# EAGLE schematic mv-uart (EAGLE 7.6.0)
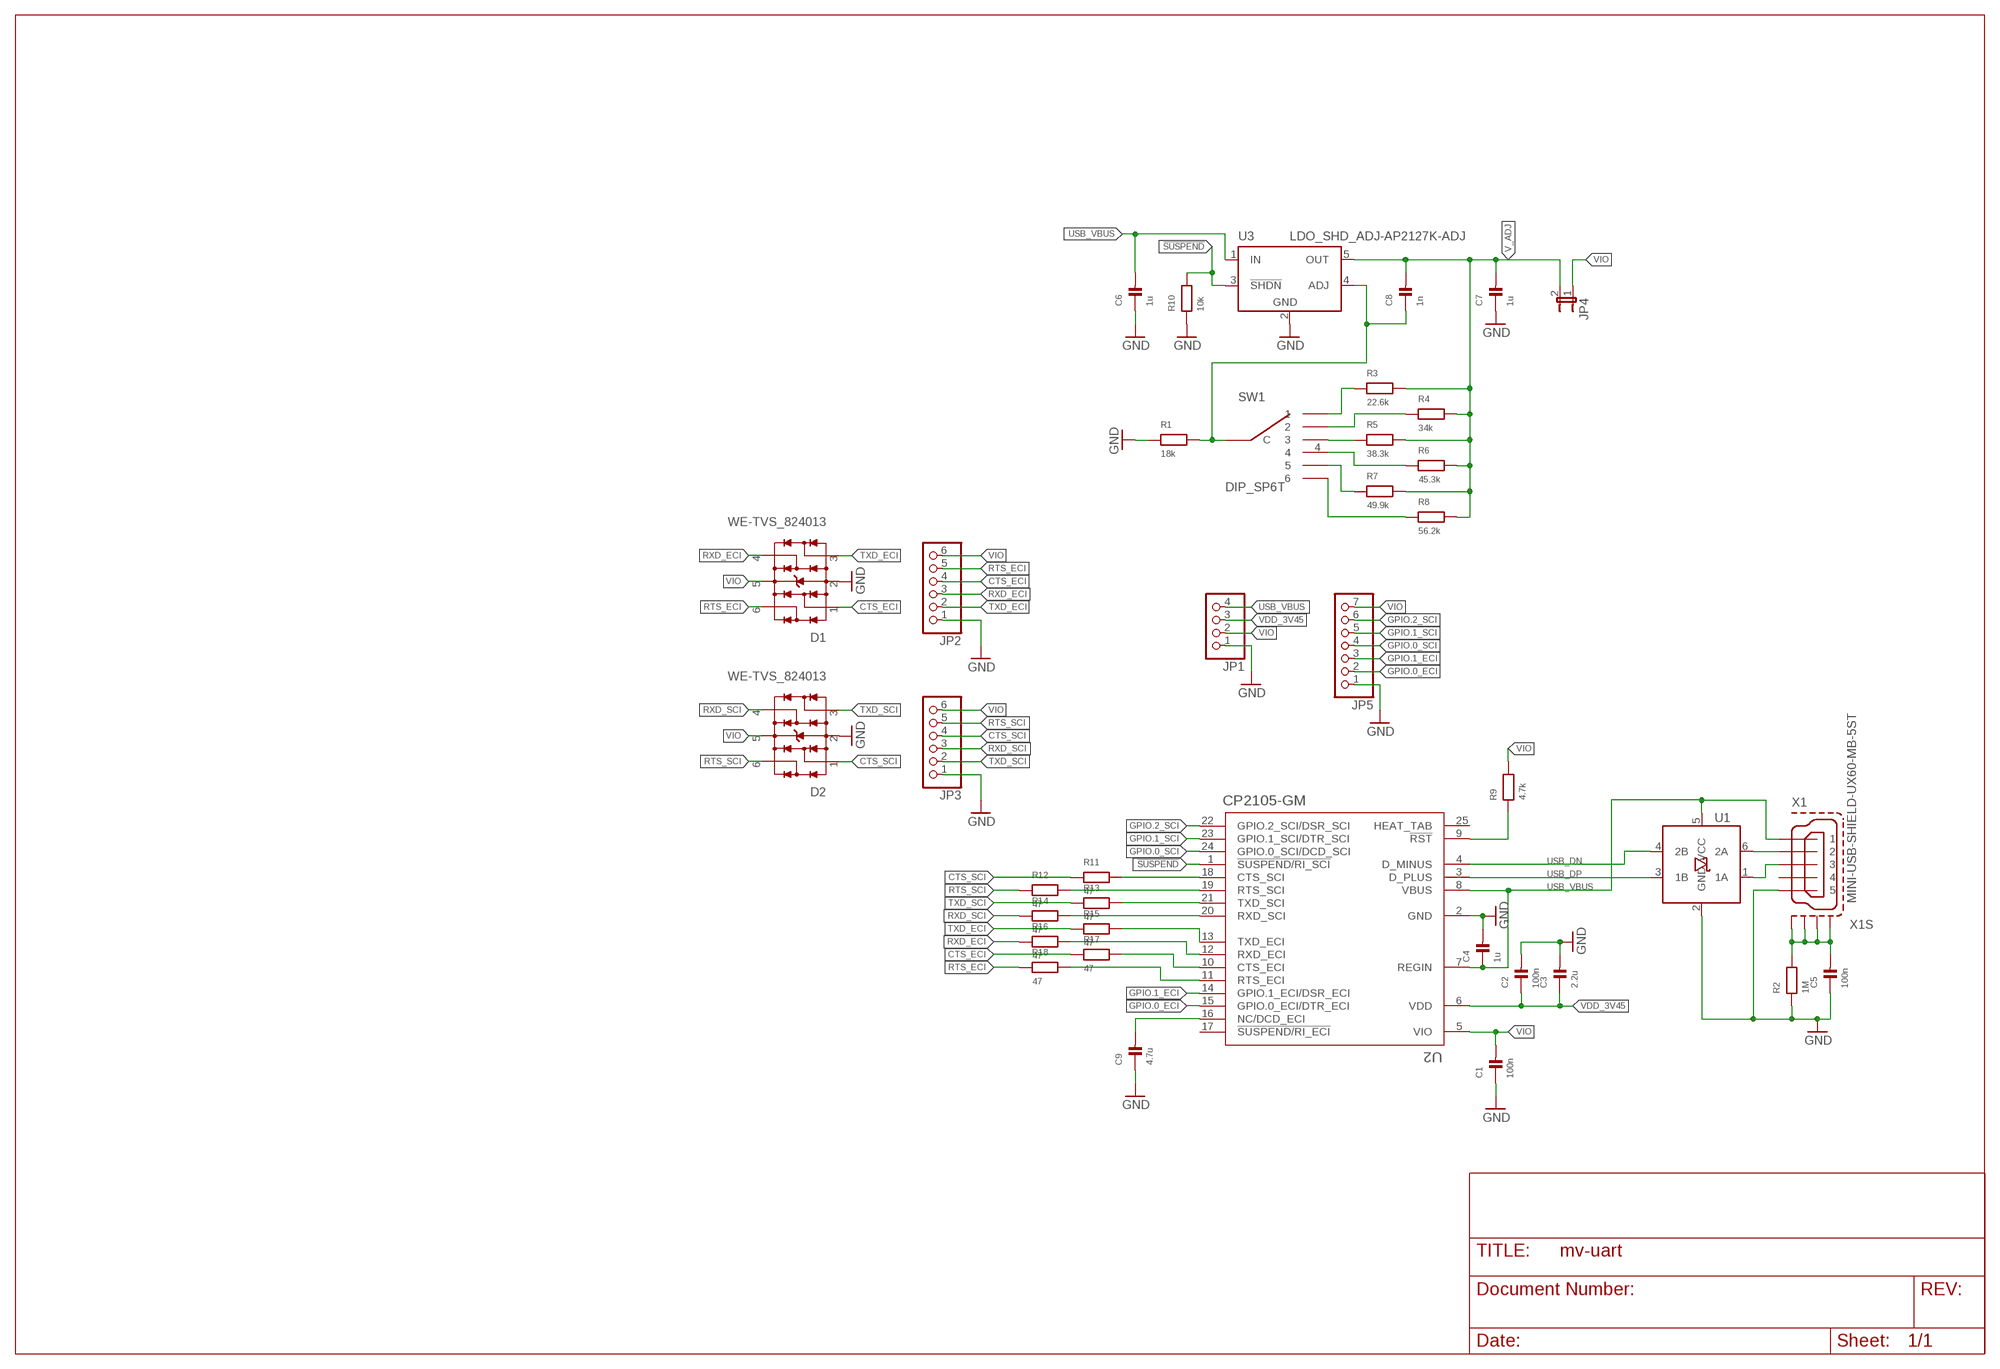
[diagram p0: schematic, sheet 1]

## Parts
C1  100n  CAP_CERAMIC_0603  [_0603]
C2  100n  CAP_CERAMIC_0603  [_0603]
C3  2.2u  CAP_CERAMIC_0603  [_0603]
C4  1u  CAP_CERAMIC_0603  [_0603]
C5  100n  CAP_CERAMIC_0603  [_0603]
C6  1u  CAP_CERAMIC_0603  [_0603]
C7  1u  CAP_CERAMIC_0603  [_0603]
C8  1n  CAP_CERAMIC_0603  [_0603]
C9  4.7u  CAP_CERAMIC_0603  [_0603]
D1  WE-TVS_824013  [WE-TVS_SOT23-6L]
D2  WE-TVS_824013  [WE-TVS_SOT23-6L]
JP1  PINHD-1X4  [1X04]
JP2  PINHD-1X6/90  [1X06/90]
JP3  PINHD-1X6/90  [1X06/90]
JP4  JP1E  [JP1]
JP5  PINHD-1X7  [1X07]
R1  18k  RESISTOR_0603  [_0603]
R2  1M  RESISTOR_0603  [_0603]
R3  22.6k  RESISTOR_0603  [_0603]
R4  34k  RESISTOR_0603  [_0603]
R5  38.3k  RESISTOR_0603  [_0603]
R6  45.3k  RESISTOR_0603  [_0603]
R7  49.9k  RESISTOR_0603  [_0603]
R8  56.2k  RESISTOR_0603  [_0603]
R9  4.7k  RESISTOR_0603  [_0603]
R10  10k  RESISTOR_0603  [_0603]
R11  47  RESISTOR_0603  [_0603]
R12  47  RESISTOR_0603  [_0603]
R13  47  RESISTOR_0603  [_0603]
R14  47  RESISTOR_0603  [_0603]
R15  47  RESISTOR_0603  [_0603]
R16  47  RESISTOR_0603  [_0603]
R17  47  RESISTOR_0603  [_0603]
R18  47  RESISTOR_0603  [_0603]
SW1  DIP_SP6T  [DIP_SP6T]
U1  IP4234CZ6  [TSOP-6]
U2  CP2105-GM  [QFN24_4X4]
U3  LDO_SHD_ADJ-AP2127K-ADJ  [SOT23L]
X1  MINI-USB-SHIELD-UX60-MB-5ST  [UX60-MB-5ST]

## Nets
!SUSPEND: R10.2 U2.1(!SUSPEND/RI_SCI) U3.3(!SHDN)
_USB_DN: U1.6(2A) X1.2
_USB_DP: U1.1(1A) X1.3
CTS_ECI: D1.1 JP2.4 R17.1
CTS_SCI: D2.1 JP3.4 R11.1
GND: C1.1 C2.2 C3.2 C4.2 C5.1 C6.1 C7.1 C9.1 D1.2(GND) D2.2(GND) JP1.1 JP2.1 JP3.1 JP5.1 R1.1 R2.1 R10.1 U1.2(GND) U2.2(GND) U3.2(GND) X1.5
GPIO.0_ECI: JP5.2 U2.15(GPIO.0_ECI/DTR_ECI)
GPIO.0_SCI: JP5.4 U2.24(GPIO.0_SCI/DCD_SCI)
GPIO.1_ECI: JP5.3 U2.14(GPIO.1_ECI/DSR_ECI)
GPIO.1_SCI: JP5.5 U2.23(GPIO.1_SCI/DTR_SCI)
GPIO.2_SCI: JP5.6 U2.22(GPIO.2_SCI/DSR_SCI)
N$1: R3.1 SW1.1
N$2: R4.1 SW1.2
N$3: R5.1 SW1.3
N$4: R6.1 SW1.4
N$5: C5.2 R2.2 X1.M1(S1) X1.M2(S2) X1.M3(S3) X1.M4(S4)
N$6: R7.1 SW1.5
N$7: R8.1 SW1.6
N$8: R9.1 U2.9(!RST)
N$9: C9.2 U2.16(NC/DCD_ECI)
N$10: R11.2 U2.18(CTS_SCI)
N$11: R12.2 U2.19(RTS_SCI)
N$12: R13.2 U2.21(TXD_SCI)
N$13: R14.2 U2.20(RXD_SCI)
N$14: R15.2 U2.13(TXD_ECI)
N$15: C8.1 R1.2 SW1.C U3.4(ADJ)
N$16: R16.2 U2.12(RXD_ECI)
N$17: R17.2 U2.10(CTS_ECI)
N$18: R18.2 U2.11(RTS_ECI)
RTS_ECI: D1.6 JP2.5 R18.1
RTS_SCI: D2.6 JP3.5 R12.1
RXD_ECI: D1.4 JP2.3 R16.1
RXD_SCI: D2.4 JP3.3 R14.1
TXD_ECI: D1.3 JP2.2 R15.1
TXD_SCI: D2.3 JP3.2 R13.1
USB_DN: U1.4(2B) U2.4(D_MINUS)
USB_DP: U1.3(1B) U2.3(D_PLUS)
USB_VBUS: C4.1 C6.2 JP1.4 U1.5(VCC) U2.7(REGIN) U2.8(VBUS) U3.1(IN) X1.1
V_ADJ: C7.2 C8.2 JP4.2 R3.2 R4.2 R5.2 R6.2 R7.2 R8.2 U3.5(OUT)
VDD_3V45: C2.1 C3.1 JP1.3 U2.6(VDD)
VIO: C1.2 D1.5(VDD) D2.5(VDD) JP1.2 JP2.6 JP3.6 JP4.1 JP5.7 R9.2 U2.5(VIO)
Unconnected: U2.17(!SUSPEND/RI_ECI) U2.25(HEAT_TAB) X1.4

## Library data of the parts
C1-C9 = rc-sysmocom:CAP_CERAMIC: Ceramic Capacitors 0402 - 0402 Surface Mount Capacitors 16pF 50V 5% [Digikey: 445-4899-2-ND] 18pF 50V 5% [Digikey: 490-1281-2-ND] 22pF 50V 5% [Digikey: 490-1283-2-ND] 68pF 50V 5% [Digikey: 490-1289-2-ND] 0.1uF 10V 10% [Digikey: 490-1318-2-ND] 1.0uF 6.3V 10% [Digikey: 490-1320-2-ND] 0603 - 0603 Surface Mount Capacitors 16 pF 50V 5% [Digikey: 445-5051-2-ND] 22 pF 50V [Digikey: PCC220ACVTR-ND] 33 pF 50V 5% [Digikey: 490-1415-1-ND] 56pF 50V 5% [Digikey: 490-1421-1-ND] 220pF 50V 5% [Digikey: 445-1285-1-ND] 680 pF 50V 2200 pF 50V 5% C0G [Digikey: 445-1297-1-ND] 5600 pF 100V 5% X7R [Digikey: 478-3711-1-ND] 0.1 µF 25V 10% [Digikey: PCC2277TR-ND] 0.22 µF 16V 10% X7R [Digikey: 445-1318-1-ND] 1.0 µF 25V 10% [Digikey: 445-5146-2-ND] 0603 - RF Specific 3pF 250V +/-0.1pF RF [Digikey: 712-1347-1-ND] 18 pF 250V 5% [Digikey: 478-3505-1-ND or 712-1322-1-ND] 56 pF 250V 5% C0G RF [Digikey: 490-4867-1-ND] 68 pF 250V RF [Digikey: 490-4868-1-ND] 0805 - 0805 Surface Mount Capacitors 220 pF 250V 2% RF Ceramic Capacitor [Digikey: 712-1398-1-ND] 1000 pF 50V 2% NP0 Ceramic Capacitor [Digikey: 478-3760-1-ND] 0.1 µF 25V 10% Ceramic Capacitor [Digikey: PCC1828TR-ND] 1.0 µF 16V 10% Ceramic Capacitor[Digikey: 490-1691-2-ND] 10.0 µF 10V 10% Ceramic Capacitor[Digikey: 709-1228-1-ND] 10.0 uF 16V 10% Ceramic Capacitor [Digikey: 478-5165-2-ND] 47 uF 6.3V 20% Ceramic Capacitor [Digikey: 587-1779-1-ND or 399-5506-1-ND] 1206 - 1206 Surface Mount Capacitors 47uF 10V 20% Ceramic Capacitor [Digikey: 490-5528-1-ND or 399-5508-1-ND or 445-6010-1-ND] 100uF 6.3V -20%, +80% Y5V Ceramic Capacitor (Digikey: 490-4512-1-ND, Mouser: 81-GRM31CF50J107ZE1L) 1810 - 1810 Surface Mount Capacitors High volt MLC; no solder stop between for higher isolation
D1 D2 = Wuerth_Elektronik_eiSos_V6_20140807:WE-TVS_824013: TVS Diode Array WE-TVS, High Speed Series - Low capazity - No leakage current - Low clamping voltage - high ESD voltage protection -- 3.3 VDC Application <http://katalog.we-online.de/media/images/eisos/VarTVS_highspeed_pf2.jpg.jpg> Details see: http://katalog.we-online.de/en/pbs/WE-TVS_High_Speed? Updated by Dan Xu 2014-07-11 2014 (C) Würth Elektronik
JP1 = pinhead:PINHD-1X4: PIN HEADER
JP2 JP3 = pinhead:PINHD-1X6: PIN HEADER
JP4 = jumper:JP1E: JUMPER
JP5 = pinhead:PINHD-1X7: PIN HEADER
R1-R18 = rc-sysmocom:RESISTOR: Resistors 0402 - 0402 Surface Mount Package 22 Ohm 1% 1/16W [Digikey: 311-22.0LRTR-ND] 33 Ohm 5% 1/16W 1.0K 5% 1/16W 1.5K 5% 1/16W 2.0K 1% 1/16W 10.0K 1% 1/16W [Digikey: 311-10.0KLRTR-ND] 10.0K 5% 1/16W [Digikey: RMCF0402JT10K0TR-ND] 12.1K 1% 1/16W [Digikey: 311-22.0LRTR-ND] 100.0K 5% 1/16W 0603 - 0603 Surface Mount Package 1/10 Watt 0805 - 0805 Surface Mount Package 1/8 Watt 1206 - 1206 Surface Mount Package 2012 - 2010 Surface Mount Package 0.11 Ohm 1/2 Watt 1% Resistor - Digikey: RHM.11UCT-ND
SW1 = laforge:DIP_SP6T: DIP SP6T switch COPAL SS-10-16
U1 = laforge:IP4234CZ6: NXP IP4234CZ6 - Single USB 2.0 ESD protection to IEC 61000-4-2 level 4; OC_DIGIKEY: 568-5869-1-ND
U2 = usb-uart:CP2105-GM: SiLabs CB2105 dual USB UART; OC_DIGIKEY: 336-2009-5-ND
U3 = ldo:LDO_SHD_ADJ: 1000mA LDO
X1 = con-hirose:MINI-USB-SHIELD-: MINI USB Connector Source: http://www.hirose.co.jp/cataloge_hp/e24000019.pdf; OC_FARNELL: unknown; OC_NEWARK: unknown